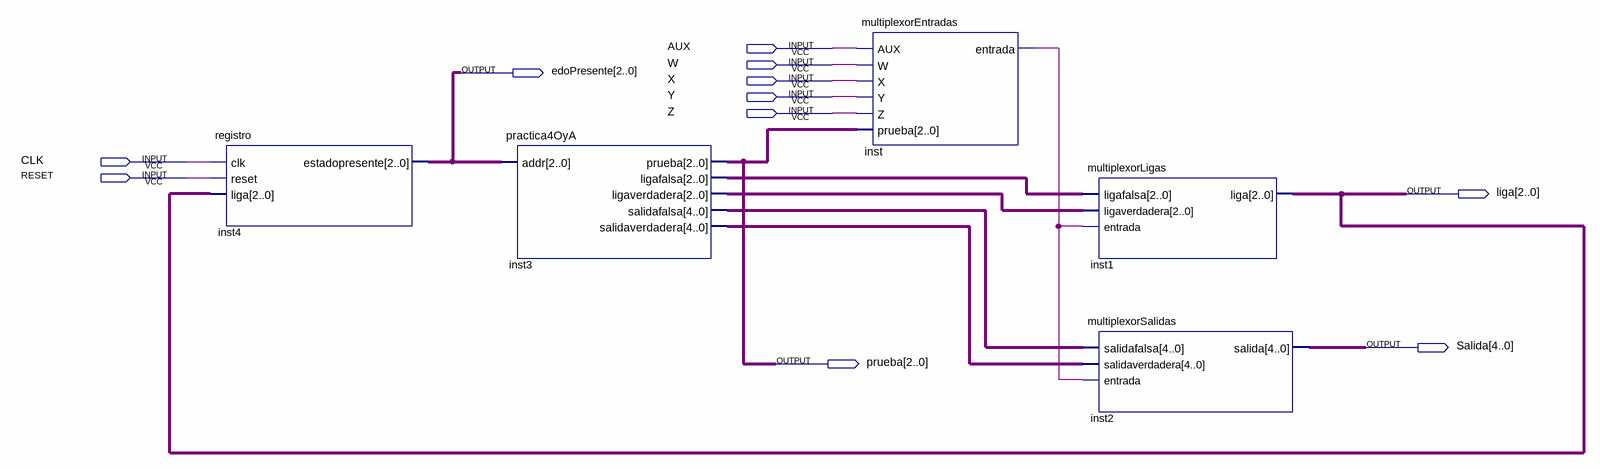
[diagram p0: schematic sheet]
// Quartus schematic Practica4.bdf as structural Verilog: 5 symbols, 11 pins
module Practica4 (
  input  AUX,
  input  W,
  input  X,
  input  Y,
  input  Z,
  input  CLK,
  input  RESET,
  output [2:0] edoPresente,
  output [2:0] liga,
  output [4:0] Salida,
  output [2:0] prueba
);

  wire inst_entrada;
  wire [2:0] inst3_ligafalsa, inst3_ligaverdadera;
  wire [4:0] inst3_salidafalsa, inst3_salidaverdadera;

  registro inst4 (.clk(CLK), .reset(RESET), .liga(liga), .estadopresente(edoPresente));
  practica4OyA inst3 (
    .addr(edoPresente), .prueba(prueba), .ligafalsa(inst3_ligafalsa), .ligaverdadera(inst3_ligaverdadera),
    .salidafalsa(inst3_salidafalsa), .salidaverdadera(inst3_salidaverdadera));
  multiplexorEntradas inst (.AUX(AUX), .W(W), .X(X), .Y(Y), .Z(Z), .prueba(prueba), .entrada(inst_entrada));
  multiplexorLigas inst1 (
    .ligafalsa(inst3_ligafalsa), .ligaverdadera(inst3_ligaverdadera), .entrada(inst_entrada), .liga(liga));
  multiplexorSalidas inst2 (
    .salidafalsa(inst3_salidafalsa), .salidaverdadera(inst3_salidaverdadera), .entrada(inst_entrada),
    .salida(Salida));
endmodule
